# Altium schematic sheet Sheet1.SchDoc
size B; SheetNumber: 1; SheetTotal: 1
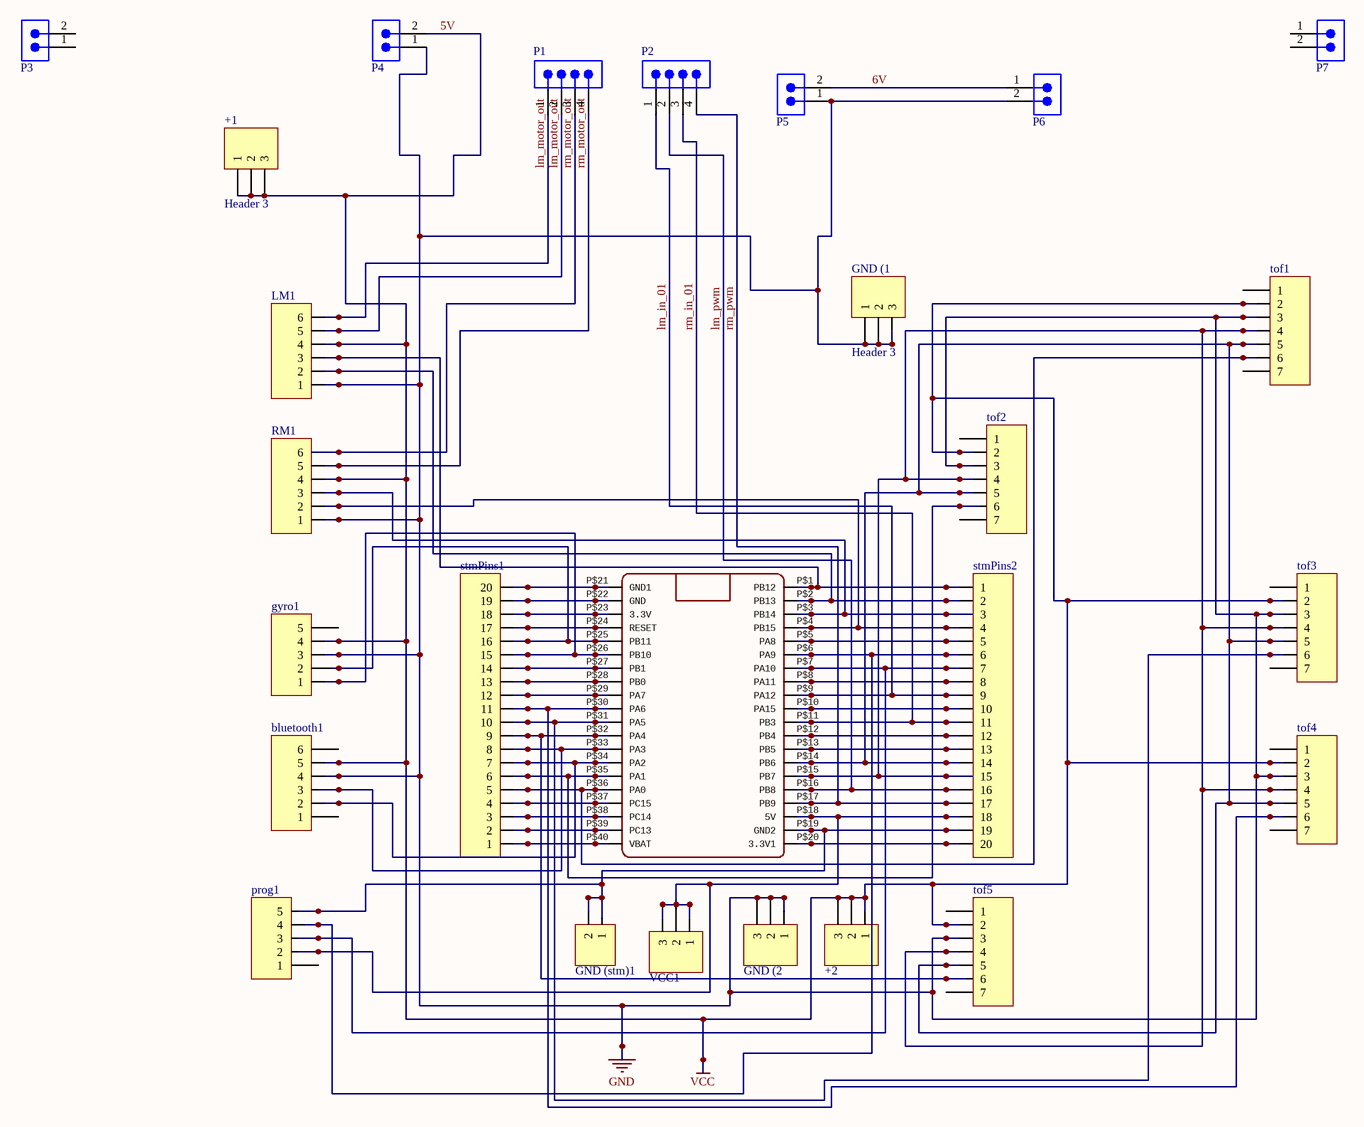
[diagram p0: Sheet1.SchDoc]

## Parts
+1  Header 3  [HDR1X3]
+2  Header 3  [HDR1X3]  (value not drawn)
bluetooth1  Header 6  [HDR1X6]  (value not drawn)
GND_(1  Header 3  [HDR1X3]
GND_(2  Header 3  [HDR1X3]  (value not drawn)
GND_(stm)1  Header 2  [HDR1X2]  (value not drawn)
gyro1  Header 5  [HDR1X5]  (value not drawn)
LM1  Header 6  [HDR1X6]  (value not drawn)
P1  653104124022  [653104124022]  (value not drawn)
P2  653104124022  [653104124022]  (value not drawn)
P3  653102124022  [653102124022]  (value not drawn)
P4  653102124022  [653102124022]  (value not drawn)
P5  653102124022  [653102124022]  (value not drawn)
P6  653102124022  [653102124022]  (value not drawn)
P7  653102124022  [653102124022]  (value not drawn)
prog1  Header 5  [HDR1X5]  (value not drawn)
RM1  Header 6  [HDR1X6]  (value not drawn)
stm1  (no value)  [BLUE_PILL]
stmPins1  Header 20  [HDR1X20]  (value not drawn)
stmPins2  Header 20  [HDR1X20]  (value not drawn)
tof1  Header 7  [HDR1X7]  (value not drawn)
tof2  Header 7  [HDR1X7]  (value not drawn)
tof3  Header 7  [HDR1X7]  (value not drawn)
tof4  Header 7  [HDR1X7]  (value not drawn)
tof5  Header 7  [HDR1X7]  (value not drawn)
VCC1  Header 3  [HDR1X3]  (value not drawn)

## Nets
5V: +1.1 +1.2 +1.3 +2.1 +2.2 +2.3 bluetooth1.5 gyro1.4 LM1.4 P4.2 RM1.4 tof1.2 tof2.2 tof3.2 tof4.2 tof5.2  [also labelled VCC]
GND: bluetooth1.4 GND_(1.1 GND_(1.2 GND_(1.3 GND_(2.1 GND_(2.2 GND_(2.3 gyro1.3 LM1.1 P4.1 P5.1 P6.2 RM1.1 tof1.3 tof2.3 tof3.3 tof4.3 tof5.3
6V: P5.2 P6.1
lm_in_01: P2.1 stm1.P$9(PA12) stmPins2.9
lm_motor_out: LM1.5 LM1.6 P1.1 P1.2
lm_pwm: P2.2 stm1.P$16(PB8) stmPins2.16
rm_in_01: P2.3 stm1.P$11(PB3) stmPins2.11
rm_motor_out: P1.3 P1.4 RM1.5 RM1.6
rm_pwm: P2.4 stm1.P$17(PB9) stmPins2.17
Netbluetooth1_2: bluetooth1.2 stm1.P$34(PA2) stmPins1.7
Netbluetooth1_3: bluetooth1.3 stm1.P$33(PA3) stmPins1.8
NetGND_(stm)1_1: GND_(stm)1.1 GND_(stm)1.2 prog1.5 stm1.P$19(GND2) stmPins2.19
Netgyro1_1: gyro1.1 stm1.P$26(PB10) stmPins1.15
Netgyro1_2: gyro1.2 stm1.P$25(PB11) stmPins1.16
NetLM1_2: LM1.2 stm1.P$2(PB13) stmPins2.2
NetLM1_3: LM1.3 stm1.P$1(PB12) stmPins2.1
Netprog1_2: prog1.2 stm1.P$18(5V) stmPins2.18 VCC1.1 VCC1.2 VCC1.3
Netprog1_3: prog1.3 stm1.P$7(PA10) stmPins2.7
Netprog1_4: prog1.4 stm1.P$6(PA9) stmPins2.6
NetRM1_2: RM1.2 stm1.P$4(PB15) stmPins2.4
NetRM1_3: RM1.3 stm1.P$3(PB14) stmPins2.3
Netstm1_P$5: stm1.P$5(PA8) stmPins2.5
Netstm1_P$8: stm1.P$8(PA11) stmPins2.8
Netstm1_P$10: stm1.P$10(PA15) stmPins2.10
Netstm1_P$12: stm1.P$12(PB4) stmPins2.12
Netstm1_P$13: stm1.P$13(PB5) stmPins2.13
Netstm1_P$14: stm1.P$14(PB6) stmPins2.14 tof1.5 tof2.5 tof3.5 tof4.5 tof5.5
Netstm1_P$15: stm1.P$15(PB7) stmPins2.15 tof1.4 tof2.4 tof3.4 tof4.4 tof5.4
Netstm1_P$20: stm1.P$20(3.3V1) stmPins2.20
Netstm1_P$21: stm1.P$21(GND1) stmPins1.20
Netstm1_P$22: stm1.P$22(GND) stmPins1.19
Netstm1_P$23: stm1.P$23(3.3V) stmPins1.18
Netstm1_P$24: stm1.P$24(RESET) stmPins1.17
Netstm1_P$27: stm1.P$27(PB1) stmPins1.14
Netstm1_P$28: stm1.P$28(PB0) stmPins1.13
Netstm1_P$29: stm1.P$29(PA7) stmPins1.12
Netstm1_P$30: stm1.P$30(PA6) stmPins1.11 tof4.6
Netstm1_P$31: stm1.P$31(PA5) stmPins1.10 tof3.6
Netstm1_P$32: stm1.P$32(PA4) stmPins1.9 tof5.6
Netstm1_P$35: stm1.P$35(PA1) stmPins1.6 tof2.6
Netstm1_P$36: stm1.P$36(PA0) stmPins1.5 tof1.6
Netstm1_P$37: stm1.P$37(PC15) stmPins1.4
Netstm1_P$38: stm1.P$38(PC14) stmPins1.3
Netstm1_P$39: stm1.P$39(PC13) stmPins1.2
Netstm1_P$40: stm1.P$40(VBAT) stmPins1.1

Not connected (* = marked no-connect by the designer): bluetooth1 1 6; gyro1 5; P3 1 2; P7 1 2; prog1 1; tof1 1 7; tof2 1 7; tof3 1 7; tof4 1 7; tof5 1 7

## Library data of the parts
+1 +2 GND_(1 GND_(2 VCC1 = Header 3: Header, 3-Pin; LatestRevisionDate: 17-Jul-2002; LatestRevisionNote: Re-released for DXP Platform.; Publisher: Altium Limited
bluetooth1 LM1 RM1 = Header 6: Header, 6-Pin; LatestRevisionDate: 17-Jul-2002; LatestRevisionNote: Re-released for DXP Platform.; Publisher: Altium Limited
GND_(stm)1 = Header 2: Header, 2-Pin; LatestRevisionDate: 17-Jul-2002; LatestRevisionNote: Re-released for DXP Platform.; Publisher: Altium Limited
gyro1 prog1 = Header 5: Header, 5-Pin; LatestRevisionDate: 17-Jul-2002; LatestRevisionNote: Re-released for DXP Platform.; Publisher: Altium Limited
P1 P2 = CMP-1502-00759-2: NexarPartId: 18818277; Insulation: Insulated; Gender: Male; Number of Positions: 4; Insulation Resistance: 100MΩ; Voltage Rating: 125V; Connector Type: Male Pin; Current Rating: 1A; Pitch: 1.25mm; Contact Resistance: 20mΩ; Housing Material: Nylon; Number of Pins: 4; Mount: Surface Mount; Width: 9.75mm; Flammability Rating: UL94 V-0; Max Operating Temperature: 85°C; Contact Gender: Male; Orientation: Vertical; Contact Mating Length: 2.159mm; REACH SVHC: Unknown; Operating Supply Voltage: 125V; Height: 4.75mm; Contact Material: Copper; Min Operating Temperature: -40°C; Length: 9.75mm; Lead Pitch: 1.25mm; Contact Plating: Tin; Number of Contacts: 4; Termination: SMD/SMT; Color: Beige, White; RoHS: Compliant; Number of Rows: 1; Packaging: Tape and Reel
P3-P7 = CMP-1502-00757-2: NexarPartId: 18818273; Current Rating: 1A; Pitch: 1.25mm; Gender: Male; Connector Type: Male Pin; Insulation Resistance: 100MΩ; Contact Resistance: 20mΩ; Operating Supply Voltage: 125V; Number of Positions: 2; Insulation: Insulated; Number of Pins: 2; Flammability Rating: UL94 V-0; Number of Rows: 1; Termination: SMD/SMT; Width: 7.25mm; Contact Material: Copper; Color: Beige, White; Contact Gender: Male; Housing Material: Nylon; Contact Mating Length: 2.159mm; RoHS: Compliant; Orientation: Vertical; Min Operating Temperature: -40°C; Max Operating Temperature: 85°C; Voltage Rating: 125V; Height: 4.75mm; Packaging: Tape and Reel; Lead Pitch: 1.25mm; Mount: Surface Mount; REACH SVHC: Unknown; Contact Plating: Tin; Length: 7.25mm; Number of Contacts: 2
stm1 = BLUE_PILL
stmPins1 stmPins2 = Header 20: Header, 20-Pin; LatestRevisionDate: 17-Jul-2002; LatestRevisionNote: Re-released for DXP Platform.; Publisher: Altium Limited
tof1-tof5 = Header 7: Header, 7-Pin; LatestRevisionDate: 17-Jul-2002; LatestRevisionNote: Re-released for DXP Platform.; Publisher: Altium Limited